# Altium schematic sheet BRG_Daughter_Single.SchDoc
size 431 x 279 mm; SheetNumber: 1; SheetTotal: 1
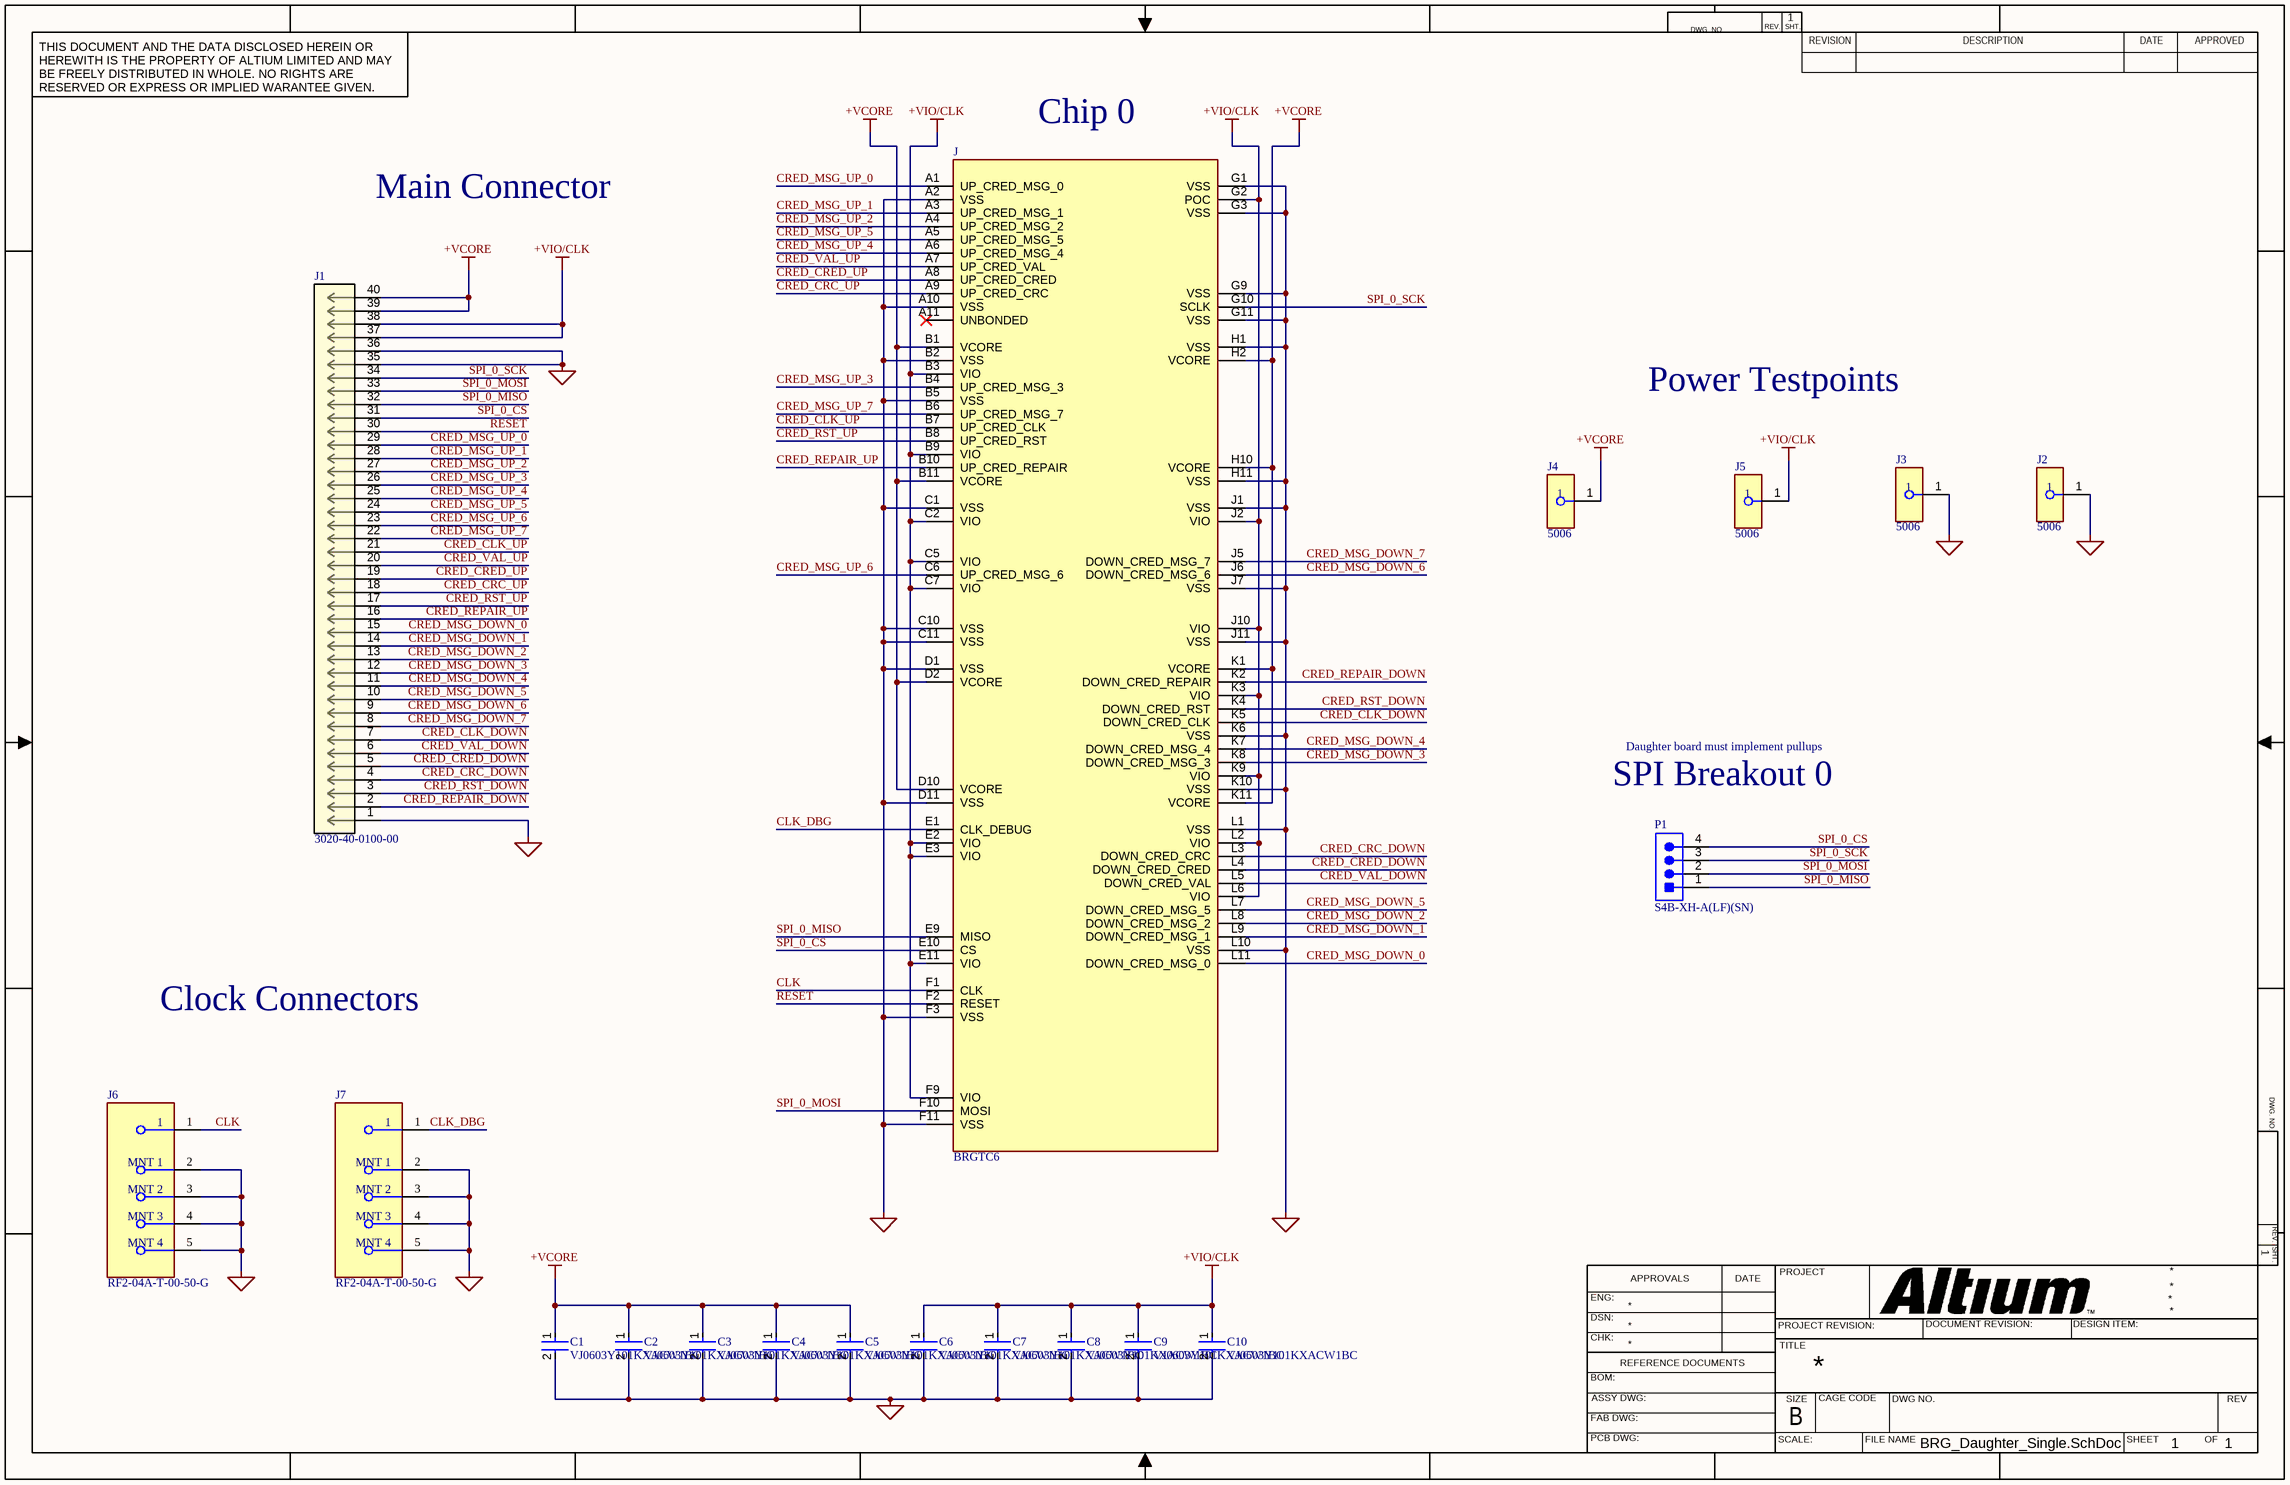
[diagram p0: BRG_Daughter_Single.SchDoc]

## Parts
C1  VJ0603Y101KXACW1BC  [FP-CC0603-DA-MFG]
C2  VJ0603Y101KXACW1BC  [FP-CC0603-DA-MFG]
C3  VJ0603Y101KXACW1BC  [FP-CC0603-DA-MFG]
C4  VJ0603Y101KXACW1BC  [FP-CC0603-DA-MFG]
C5  VJ0603Y101KXACW1BC  [FP-CC0603-DA-MFG]
C6  VJ0603Y101KXACW1BC  [FP-CC0603-DA-MFG]
C7  VJ0603Y101KXACW1BC  [FP-CC0603-DA-MFG]
C8  VJ0603Y101KXACW1BC  [FP-CC0603-DA-MFG]
C9  VJ0603Y101KXACW1BC  [FP-CC0603-DA-MFG]
C10  VJ0603Y101KXACW1BC  [FP-CC0603-DA-MFG]
J  BRGTC6  [3M_200-6311-9UN-1900]
J1  3020-40-0100-00  [CONN_3020-40-0100-00_CNC]
J2  5006  [FP-5006-MFG]
J3  5006  [FP-5006-MFG]
J4  5006  [FP-5006-MFG]
J5  5006  [FP-5006-MFG]
J6  RF2-04A-T-00-50-G  [FP-RF2-04A-T-00-50-G-MFG]
J7  RF2-04A-T-00-50-G  [FP-RF2-04A-T-00-50-G-MFG]
P1  S4B-XH-A(LF)(SN)  [JST-S4B-XH-A(LF)(SN)_V]

## Nets
+VCORE: C1.1 C2.1 C3.1 C4.1 C5.1 J.B1(VCORE) J.B11(VCORE) J.D2(VCORE) J.D10(VCORE) J.H2(VCORE) J.H10(VCORE) J.K1(VCORE) J.K11(VCORE) J1.39 J1.40 J4.1
+VIO/CLK: C6.1 C7.1 C8.1 C9.1 C10.1 J.B3(VIO) J.B9(VIO) J.C2(VIO) J.C5(VIO) J.C7(VIO) J.E2(VIO) J.E3(VIO) J.E11(VIO) J.F9(VIO) J.G2(POC) J.J2(VIO) J.J10(VIO) J.K3(VIO) J.K9(VIO) J.L2(VIO) J.L6(VIO) J1.37 J1.38 J5.1
GND: C1.2 C2.2 C3.2 C4.2 C5.2 C6.2 C7.2 C8.2 C9.2 C10.2 J.A2(VSS) J.A10(VSS) J.B2(VSS) J.B5(VSS) J.C1(VSS) J.C10(VSS) J.C11(VSS) J.D1(VSS) J.D11(VSS) J.F3(VSS) J.F11(VSS) J.G1(VSS) J.G3(VSS) J.G9(VSS) J.G11(VSS) J.H1(VSS) J.H11(VSS) J.J1(VSS) J.J7(VSS) J.J11(VSS) J.K6(VSS) J.K10(VSS) J.L1(VSS) J.L10(VSS) J1.1 J1.35 J1.36 J2.1 J3.1 J6.2(MNT_1) J6.3(MNT_2) J6.4(MNT_3) J6.5(MNT_4) J7.2(MNT_1) J7.3(MNT_2) J7.4(MNT_3) J7.5(MNT_4)
CLK: J.F1(CLK) J6.1
CLK_DBG: J.E1(CLK_DEBUG) J7.1
CRED_CLK_DOWN: J.K5(DOWN_CRED_CLK) J1.7
CRED_CLK_UP: J.B7(UP_CRED_CLK) J1.21
CRED_CRC_DOWN: J.L3(DOWN_CRED_CRC) J1.4
CRED_CRC_UP: J.A9(UP_CRED_CRC) J1.18
CRED_CRED_DOWN: J.L4(DOWN_CRED_CRED) J1.5
CRED_CRED_UP: J.A8(UP_CRED_CRED) J1.19
CRED_MSG_DOWN_0: J.L11(DOWN_CRED_MSG_0) J1.15
CRED_MSG_DOWN_1: J.L9(DOWN_CRED_MSG_1) J1.14
CRED_MSG_DOWN_2: J.L8(DOWN_CRED_MSG_2) J1.13
CRED_MSG_DOWN_3: J.K8(DOWN_CRED_MSG_3) J1.12
CRED_MSG_DOWN_4: J.K7(DOWN_CRED_MSG_4) J1.11
CRED_MSG_DOWN_5: J.L7(DOWN_CRED_MSG_5) J1.10
CRED_MSG_DOWN_6: J.J6(DOWN_CRED_MSG_6) J1.9
CRED_MSG_DOWN_7: J.J5(DOWN_CRED_MSG_7) J1.8
CRED_MSG_UP_0: J.A1(UP_CRED_MSG_0) J1.29
CRED_MSG_UP_1: J.A3(UP_CRED_MSG_1) J1.28
CRED_MSG_UP_2: J.A4(UP_CRED_MSG_2) J1.27
CRED_MSG_UP_3: J.B4(UP_CRED_MSG_3) J1.26
CRED_MSG_UP_4: J.A6(UP_CRED_MSG_4) J1.25
CRED_MSG_UP_5: J.A5(UP_CRED_MSG_5) J1.24
CRED_MSG_UP_6: J.C6(UP_CRED_MSG_6) J1.23
CRED_MSG_UP_7: J.B6(UP_CRED_MSG_7) J1.22
CRED_REPAIR_DOWN: J.K2(DOWN_CRED_REPAIR) J1.2
CRED_REPAIR_UP: J.B10(UP_CRED_REPAIR) J1.16
CRED_RST_DOWN: J.K4(DOWN_CRED_RST) J1.3
CRED_RST_UP: J.B8(UP_CRED_RST) J1.17
CRED_VAL_DOWN: J.L5(DOWN_CRED_VAL) J1.6
CRED_VAL_UP: J.A7(UP_CRED_VAL) J1.20
RESET: J.F2(RESET) J1.30
SPI_0_CS: J.E10(CS) J1.31 P1.4
SPI_0_MISO: J.E9(MISO) J1.32 P1.1
SPI_0_MOSI: J.F10(MOSI) J1.33 P1.2
SPI_0_SCK: J.G10(SCLK) J1.34 P1.3

Not connected (* = marked no-connect by the designer): J A11(UNBONDED)*

## Notes on the sheet
- Chip 0
- Main Connector
- Power Testpoints
- Daughter board must implement pullups
- (near P1) SPI Breakout 0
- Clock Connectors
- DWG. NO.
- REV.
- SHT.
- THIS DOCUMENT AND THE DATA DISCLOSED HEREIN OR HEREWITH IS THE PROPERTY OF ALTIUM LIMITED AND MAY BE FREELY DISTRIBUTED IN WHOLE. NO RIGHTS ARE RESERVED OR EXPRESS OR IMPLIED WARANTEE GIVEN.
- REVISION
- DESCRIPTION
- DATE
- APPROVED
- ENG:
- APPROVALS
- PROJECT
- DSN:
- CHK:
- REFERENCE DOCUMENTS
- PROJECT REVISION:
- TITLE
- DOCUMENT REVISION:
- DESIGN ITEM:
- BOM:
- FAB DWG:
- PCB DWG:
- ASSY DWG:
- SCALE:
- SIZE
- B
- CAGE CODE
- FILE NAME
- DWG NO.
- SHEET
- OF
- REV

## Library data of the parts
C1-C10 = CMP-2000-05002-2: CAP CER 0.1UF 16V X7R 0603; Manufacturer Part Number: CC0603KRX7R7BB104; Manufacturer: YAGEO; Tolerance: 0.1; Value: 100 nF; Temperature Coefficient: 15%; Material: Ceramic; Voltage Rating: 16 V; Package: CC0603-DA; ComponentLink2Description: Datasheet; Octopart: https://octopart.com/cc0603krx7r7bb104-yageo-192941; Temperature Range High: +125°C; Digikey Description: CAP CER 0.1UF 16V X7R 0603; Voltage: 16 V; Device Class L2: Capacitors; Height: 0.9mm; Temperature: -55°C to +125°C; Device Class L1: Passive Components; Device Class L3: Ceramic Capacitors; ComponentLink2URL: http://www.yageo.com/documents/recent/UPY-GPHC_X7R_6.3V-to-50V_18.pdf; Footprint Url: http://www.yageo.com/exep/pages/download/literatures/UPY-C_GEN_24.pdf; RoHS: TRUE; Temperature Range Low: -55°C; Temperature Characteristic: X7R; Lead Free: Yes; Capacitance: 100 nF; Category: Cap; Mouser Description: Multilayer Ceramic Capacitor, CC Series, 0.1 - F, - 10%, X7R, 16 V, 0603 [1608 Metric]; Automotive: No
J = 200-6311-9UN-1900: 121 _11 x 11_ Pos PGA, ZIF _ZIP_ Socket Gold Through Hole; MF: 3M; SnapEDA_Link: https://www.snapeda.com/parts/200-6311-9UN-1900/3M%20_TC_/view-part/159310/?ref=snap; Digi-Key_Part_Number: 3M5067-ND; MP: 200-6311-9UN-1900; Package: None; Digi-Key_Purchase_URL: https://www.digikey.com/product-detail/en/3m/200-6311-9UN-1900/3M5067-ND/1130121?utm_source=snapeda&utm_medium=aggregator&utm_campaign=symbol; Value: *
J1 = 3020-40-0100-00: No Description Available; Mfr_Name: CNC Tech; RefDes: RefDes; Type: Type
J2-J5 = CMP-19636-000022-1: PC TEST POINT COMPACT BLACK; Body Material: Bronze; Inside Diameter: 1.78mm; Number of Ports: 1; Hole Diameter: 1.6mm; Outside Diameter: 3.18mm; Plating: Silver; Contact Plating: Tin; Color: Black; RoHS Compliant: Yes; Flammability Rating: UL94 V-0; Contact Material: Bronze; Material: Nylon; Orientation: Straight; Package Quantity: 100; Housing Color: Black; Length: 8.89mm; Series: THM; Mount: PCB; Height: 0.35inch; Packaging: Bulk; REACH SVHC: No SVHC; Insulation Material: Nylon; Lead Free: Lead Free
J6 J7 = CMP-42753-000002-1: CONN SMA JACK STR 50 OHM PCB
P1 = CMP-1755-00007-1: Male Header, Pitch 2.5 mm, 1 x 4 Position, Height 6.1 mm, Tail Length 3.4 mm, -25 to 85 degC, RoHS, Bulk; PackageReference: S4B-XH-A(LF)(SN); ComponentLink1Description: Manufacturer URL; DatasheetVersion: May-16; ComponentLink2Description: Datasheet; ComponentLink2URL: http://www.jst-mfg.com/product/pdf/eng/eXH.pdf; ComponentLink1URL: http://www.jst.com/home2.html; PackageDescription: Male Header, Pitch 2.5 mm, 1 x 4 Position, Height 6.1 mm, Tail Length 3.4 mm